# Altium project shield2Gen.PrjPcb
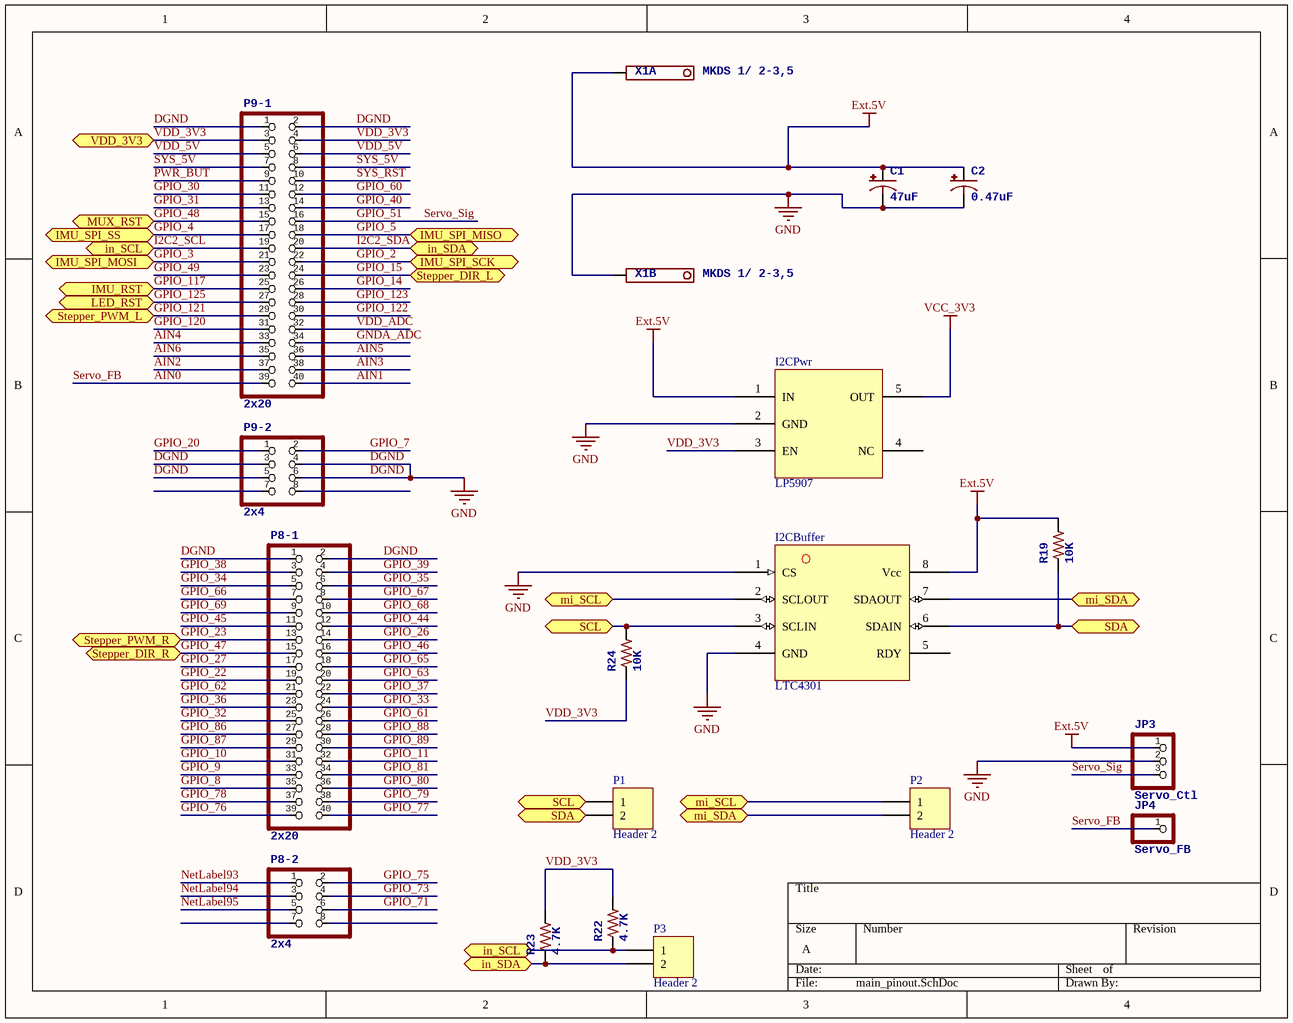
[diagram p0: main_pinout.SchDoc]
4 sheets, 46 parts. Net scope: flat (ports and power ports of the same name join across sheets).
Board file: SHield2Gen.PcbDoc
Sheets:
  main_pinout.SchDoc
  IRReceiver.SchDoc
  LED_Band.SchDoc
  IMU_Core.SchDoc

## Sheet main_pinout.SchDoc
size A

### Parts
C1  47uF  [E2,5-7]
C2  0.47uF  [E5-6]
I2CBuffer  LTC4301  [TSSOP-8]
I2CPwr  LP5907  [SOT23-5L]
JP3  Servo_Ctl  [1X03]
JP4  Servo_FB  [1X01]
P1  Header 2  [HDR1X2]
P2  Header 2  [HDR1X2]
P3  Header 2  [HDR1X2]
P8-1  2x20  [2X20]
P8-2  2x4  [2X04]
P9-1  2x20  [2X20]
P9-2  2x4  [2X04]
R19  10K  [R0805]
R22  4.7K  [R0805]
R23  4.7K  [R0805]
R24  10K  [R0805]
X1  MKDS 1/ 2-3,5  [1751248]  (parts A,B of 2)

### Ports
IMU_RST, IMU_SPI_MISO, IMU_SPI_MOSI, IMU_SPI_SCK, IMU_SPI_SS, in_SCL, in_SDA, LED_RST, mi_SCL, mi_SDA, MUX_RST, SCL, SDA, Stepper_DIR_L, Stepper_DIR_R, Stepper_PWM_L, Stepper_PWM_R, VDD_3V3

### Nets
DGND: C1.- C2.- I2CBuffer.1(CS) I2CBuffer.4(GND) I2CPwr.2(GND) JP3.2 P8-1.1 P8-1.2 P9-1.1 P9-1.2 P9-2.3 P9-2.4 P9-2.5 P9-2.6 X1.2(K)  [also labelled GND]
Ext.5V: C1.+ C2.+ I2CBuffer.8(Vcc) I2CPwr.1(IN) JP3.1 R19.2 X1.1(K)
VCC_3V3: I2CPwr.5(OUT)
AIN0: JP4.1 P9-1.39  [also labelled Servo_FB]
AIN1: P9-1.40
AIN2: P9-1.37
AIN3: P9-1.38
AIN4: P9-1.33
AIN5: P9-1.36
AIN6: P9-1.35
GNDA_ADC: P9-1.34
GPIO_2: P9-1.22 ; port IMU_SPI_SCK
GPIO_3: P9-1.21 ; port IMU_SPI_MOSI
GPIO_4: P9-1.17 ; port IMU_SPI_SS
GPIO_5: P9-1.18 ; port IMU_SPI_MISO
GPIO_7: P9-2.2
GPIO_8: P8-1.35
GPIO_9: P8-1.33
GPIO_10: P8-1.31
GPIO_11: P8-1.32
GPIO_14: P9-1.26
GPIO_15: P9-1.24 ; port Stepper_DIR_L
GPIO_20: P9-2.1
GPIO_22: P8-1.19
GPIO_23: P8-1.13 ; port Stepper_PWM_R
GPIO_26: P8-1.14
GPIO_27: P8-1.17
GPIO_30: P9-1.11
GPIO_31: P9-1.13
GPIO_32: P8-1.25
GPIO_33: P8-1.24
GPIO_34: P8-1.5
GPIO_35: P8-1.6
GPIO_36: P8-1.23
GPIO_37: P8-1.22
GPIO_38: P8-1.3
GPIO_39: P8-1.4
GPIO_40: P9-1.14
GPIO_44: P8-1.12
GPIO_45: P8-1.11
GPIO_46: P8-1.16
GPIO_47: P8-1.15 ; port Stepper_DIR_R
GPIO_48: P9-1.15 ; port MUX_RST
GPIO_49: P9-1.23
GPIO_51: JP3.3 P9-1.16  [also labelled Servo_Sig]
GPIO_60: P9-1.12
GPIO_61: P8-1.26
GPIO_62: P8-1.21
GPIO_63: P8-1.20
GPIO_65: P8-1.18
GPIO_66: P8-1.7
GPIO_67: P8-1.8
GPIO_68: P8-1.10
GPIO_69: P8-1.9
GPIO_71: P8-2.6
GPIO_73: P8-2.4
GPIO_75: P8-2.2
GPIO_76: P8-1.39
GPIO_77: P8-1.40
GPIO_78: P8-1.37
GPIO_79: P8-1.38
GPIO_80: P8-1.36
GPIO_81: P8-1.34
GPIO_86: P8-1.27
GPIO_87: P8-1.29
GPIO_88: P8-1.28
GPIO_89: P8-1.30
GPIO_117: P9-1.25 ; port IMU_RST
GPIO_120: P9-1.31
GPIO_121: P9-1.29 ; port Stepper_PWM_L
GPIO_122: P9-1.30
GPIO_123: P9-1.28
GPIO_125: P9-1.27 ; port LED_RST
I2C2_SCL: P3.1 P9-1.19 R22.1 ; port in_SCL
I2C2_SDA: P3.2 P9-1.20 R23.1 ; port in_SDA
NetLabel93: P8-2.1
NetLabel94: P8-2.3
NetLabel95: P8-2.5
PWR_BUT: P9-1.9
SYS_5V: P9-1.7 P9-1.8
SYS_RST: P9-1.10
VDD_3V3: I2CPwr.3(EN) P9-1.3 P9-1.4 R22.2 R23.2 R24.1 ; port VDD_3V3
VDD_5V: P9-1.5 P9-1.6
VDD_ADC: P9-1.32
NetADC0_9: I2CBuffer.6(SDAIN) P1.2 R19.1 ; port SDA
NetADC0_10: I2CBuffer.3(SCLIN) P1.1 R24.2 ; port SCL
NetI2CBuffer_2: I2CBuffer.2(SCLOUT) P2.1 ; port mi_SCL
NetI2CBuffer_7: I2CBuffer.7(SDAOUT) P2.2 ; port mi_SDA

Not connected (* = marked no-connect by the designer): I2CBuffer 5(RDY); I2CPwr 4(NC); P8-2 7 8; P9-2 7 8

### Library data of the parts
C1 = CPOL-USE2.5-7
C2 = CPOL-USE5-6
JP3 = PINHD-1X3
JP4 = PINHD-1X1
P1-P3 = Header 2: Header, 2-Pin; LatestRevisionDate: 17-Jul-2002; LatestRevisionNote: Re-released for DXP Platform.; Publisher: Altium Limited
P8-1 P9-1 = PINHD-2X20
P8-2 P9-2 = PINHD-2X4
R19 R22-R24 = R-US_R0805
X1 = 1751248: OC_FARNELL: unknown; OC_NEWARK: unknown

## Sheet IRReceiver.SchDoc
size A
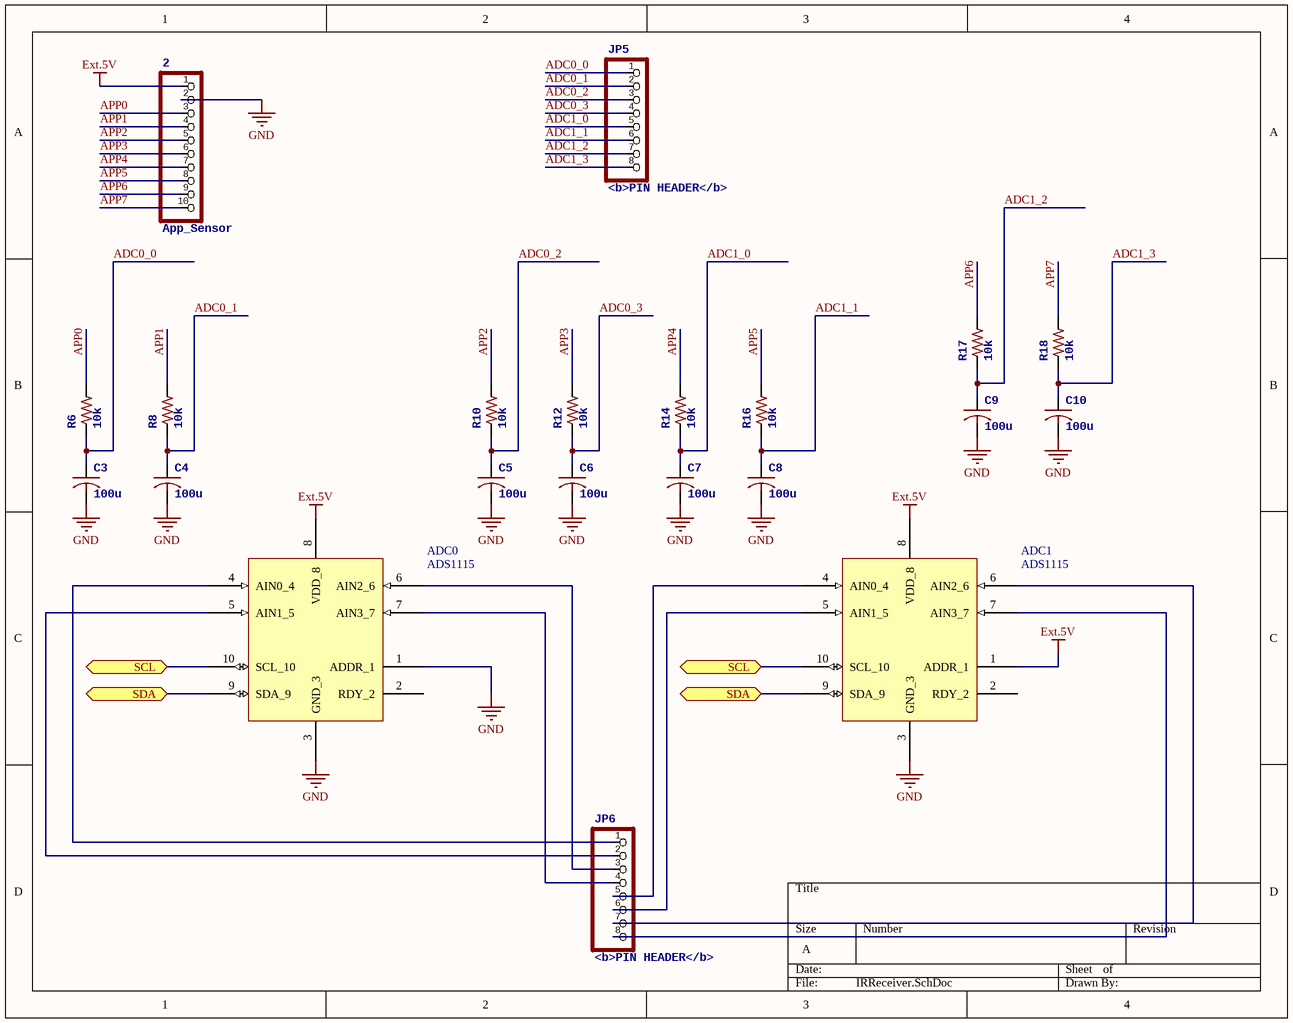
[diagram p1: IRReceiver.SchDoc]

### Parts
2  App_Sensor  [1X10-BIG]
ADC0  ADS1115  [10-VSSOP]
ADC1  ADS1115  [10-VSSOP]
C3  100u  [C0805]
C4  100u  [C0805]
C5  100u  [C0805]
C6  100u  [C0805]
C7  100u  [C0805]
C8  100u  [C0805]
C9  100u  [C0805]
C10  100u  [C0805]
JP5  <b>PIN HEADER</b>  [1X08-BIG]
JP6  <b>PIN HEADER</b>  [1X08-BIG]
R6  10k  [R0805]
R8  10k  [R0805]
R10  10k  [R0805]
R12  10k  [R0805]
R14  10k  [R0805]
R16  10k  [R0805]
R17  10k  [R0805]
R18  10k  [R0805]

### Ports
SCL, SDA

### Nets
Ext.5V: 2.1 ADC0.8(VDD_8) ADC1.1(ADDR_1) ADC1.8(VDD_8)
GND: 2.2 ADC0.1(ADDR_1) ADC0.3(GND_3) ADC1.3(GND_3) C3.2 C4.2 C5.2 C6.2 C7.2 C8.2 C9.2 C10.2  [project net DGND]
ADC0_0: C3.1 JP5.1 R6.1
ADC0_1: C4.1 JP5.2 R8.1
ADC0_2: C5.1 JP5.3 R10.1
ADC0_3: C6.1 JP5.4 R12.1
ADC1_0: C7.1 JP5.5 R14.1
ADC1_1: C8.1 JP5.6 R16.1
ADC1_2: C9.1 JP5.7 R17.1
ADC1_3: C10.1 JP5.8 R18.1
APP0: 2.3 R6.2
APP1: 2.4 R8.2
APP2: 2.5 R10.2
APP3: 2.6 R12.2
APP4: 2.7 R14.2
APP5: 2.8 R16.2
APP6: 2.9 R17.2
APP7: 2.10 R18.2
NetADC0_4: ADC0.4(AIN0_4) JP6.1
NetADC0_5: ADC0.5(AIN1_5) JP6.2
NetADC0_6: ADC0.6(AIN2_6) JP6.3
NetADC0_7: ADC0.7(AIN3_7) JP6.4
NetADC0_9: ADC0.9(SDA_9) ADC1.9(SDA_9) ; port SDA
NetADC0_10: ADC0.10(SCL_10) ADC1.10(SCL_10) ; port SCL
NetADC1_4: ADC1.4(AIN0_4) JP6.5
NetADC1_5: ADC1.5(AIN1_5) JP6.6
NetADC1_6: ADC1.6(AIN2_6) JP6.7
NetADC1_7: ADC1.7(AIN3_7) JP6.8

Not connected (* = marked no-connect by the designer): ADC0 2(RDY_2); ADC1 2(RDY_2)

### Library data of the parts
2 = PINHD-1X10
ADC0 ADC1 = ADS1115: vendor: TI
C3-C10 = C-USC0805
JP5 JP6 = PINHD-1X8BIG
R6 R8 R10 R12 R14 R16-R18 = R-US_R0805

## Sheet LED_Band.SchDoc
size A
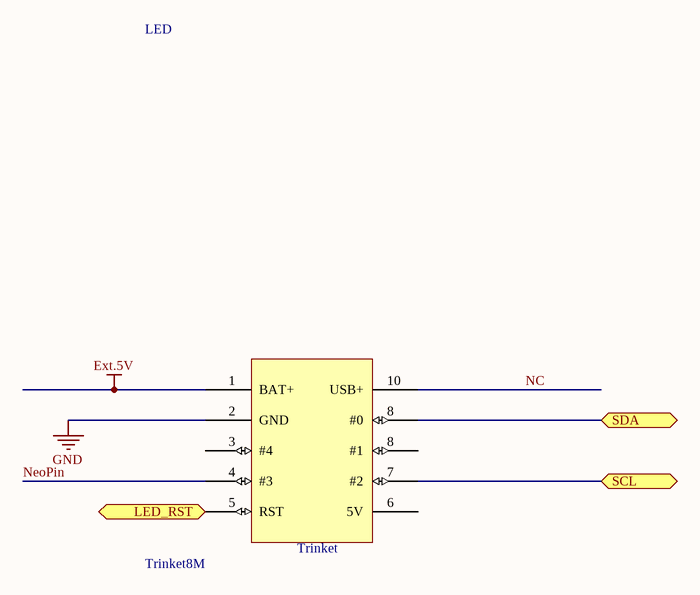
[diagram p2: LED_Band.SchDoc]

### Parts
LED  Trinket8M  [trinket]

### Ports
LED_RST, SCL, SDA

### Nets
Ext.5V: LED.1(BAT+)
GND: LED.2(GND)  [project net DGND]
GPIO_125: LED.5(RST) ; port LED_RST
NC: LED.10(USB+)
NeoPin: LED.4(#3)
NetADC0_9: LED.8(#0) ; port SDA
NetADC0_10: LED.7(#2) ; port SCL

Not connected (* = marked no-connect by the designer): LED 3(#4) 6(5V)

### Notes on the sheet
- (in symbol Trinket8M) Trinket

## Sheet IMU_Core.SchDoc
size A
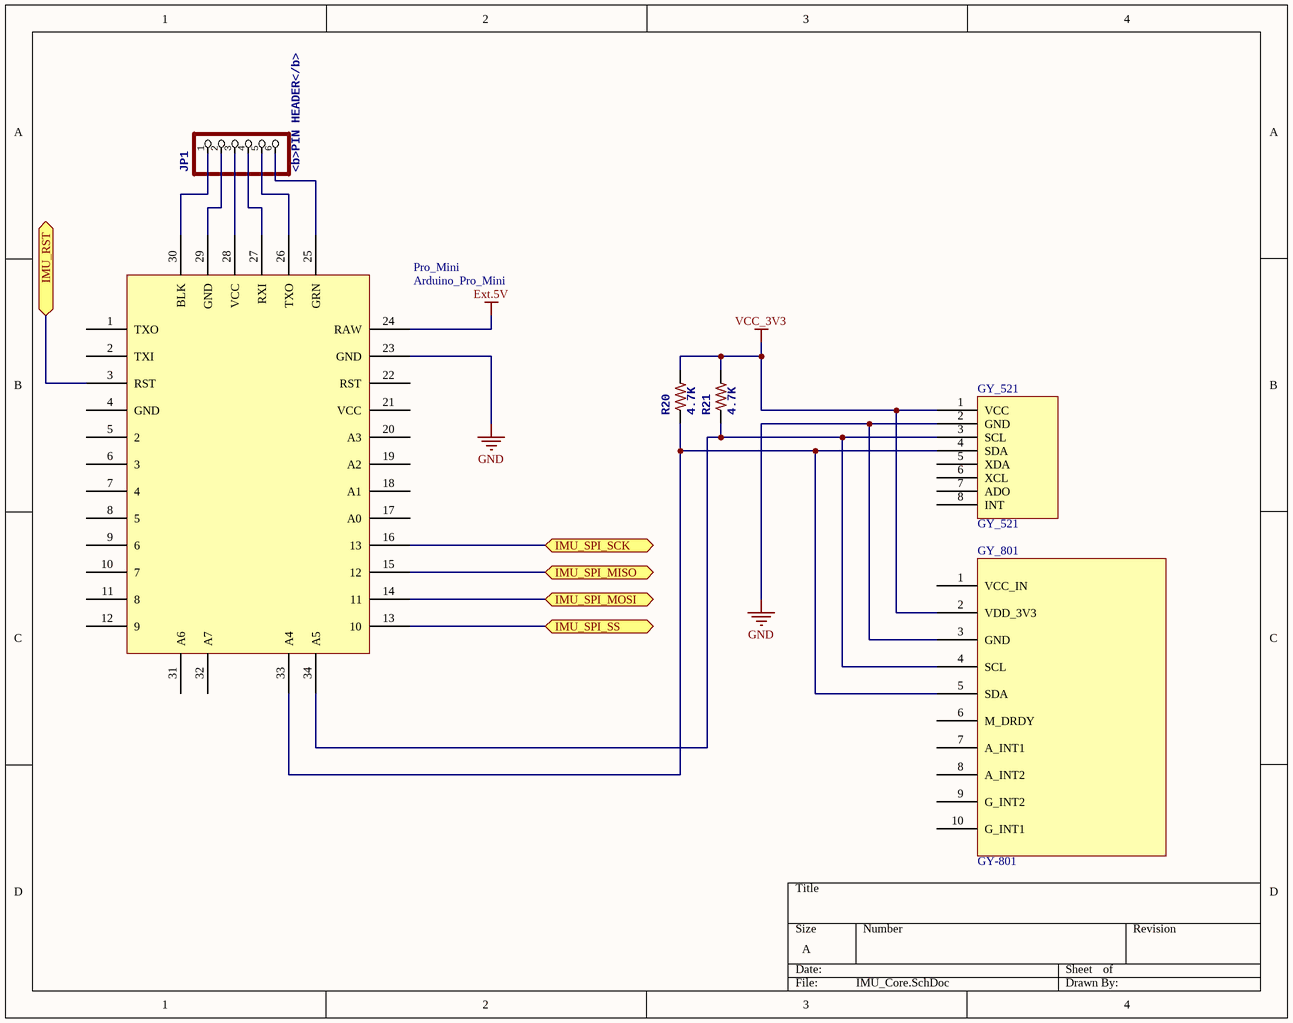
[diagram p3: IMU_Core.SchDoc]

### Parts
GY_521  GY_521  [sensor_8pin]
GY_801  GY-801  [Sensor_10Pin]
JP1  <b>PIN HEADER</b>  [1X06]
Pro_Mini  Arduino_Pro_Mini  [Arduino_pro_mini]
R20  4.7K  [R0805]
R21  4.7K  [R0805]

### Ports
IMU_RST, IMU_SPI_MISO, IMU_SPI_MOSI, IMU_SPI_SCK, IMU_SPI_SS

### Nets
Ext.5V: Pro_Mini.24(RAW)
GND: GY_521.2(GND) GY_801.3(GND) Pro_Mini.23(GND)  [project net DGND]
VCC_3V3: GY_521.1(VCC) GY_801.2(VDD_3V3) R20.2 R21.2
GPIO_2: Pro_Mini.16(13) ; port IMU_SPI_SCK
GPIO_3: Pro_Mini.14(11) ; port IMU_SPI_MOSI
GPIO_4: Pro_Mini.13(10) ; port IMU_SPI_SS
GPIO_5: Pro_Mini.15(12) ; port IMU_SPI_MISO
GPIO_117: Pro_Mini.3(RST) ; port IMU_RST
NetGY_521_3: GY_521.3(SCL) GY_801.4(SCL) Pro_Mini.34(A5) R21.1
NetGY_521_4: GY_521.4(SDA) GY_801.5(SDA) Pro_Mini.33(A4) R20.1
NetJP1_1: JP1.1 Pro_Mini.30(BLK)
NetJP1_2: JP1.2 Pro_Mini.29(GND)
NetJP1_3: JP1.3 Pro_Mini.28(VCC)
NetJP1_4: JP1.4 Pro_Mini.27(RXI)
NetJP1_5: JP1.5 Pro_Mini.26(TXO)
NetJP1_6: JP1.6 Pro_Mini.25(GRN)

Not connected (* = marked no-connect by the designer): GY_521 5(XDA) 6(XCL) 7(ADO) 8(INT); GY_801 1(VCC_IN) 6(M_DRDY) 7(A_INT1) 8(A_INT2) 9(G_INT2) 10(G_INT1); Pro_Mini 1(TXO) 2(TXI) 4(GND) 5(2) 6(3) 7(4) 8(5) 9(6) 10(7) 11(8) 12(9) 17(A0) 18(A1) 19(A2) 20(A3) 21(VCC) 22(RST) 31(A6) 32(A7)

### Library data of the parts
JP1 = PINHD-1X6
R20 R21 = R-US_R0805

## Nets that join several sheets
DGND: main_pinout (15 pins), IRReceiver (12 pins), LED_Band (LED.2), IMU_Core (GY_521.2 GY_801.3 Pro_Mini.23)
Ext.5V: main_pinout (7 pins), IRReceiver (2.1 ADC0.8 ADC1.1 ADC1.8), LED_Band (LED.1), IMU_Core (Pro_Mini.24)
VCC_3V3: main_pinout (I2CPwr.5), IMU_Core (GY_521.1 GY_801.2 R20.2 R21.2)
GPIO_2: main_pinout (P9-1.22), IMU_Core (Pro_Mini.16)
GPIO_3: main_pinout (P9-1.21), IMU_Core (Pro_Mini.14)
GPIO_4: main_pinout (P9-1.17), IMU_Core (Pro_Mini.13)
GPIO_5: main_pinout (P9-1.18), IMU_Core (Pro_Mini.15)
GPIO_117: main_pinout (P9-1.25), IMU_Core (Pro_Mini.3)
GPIO_125: main_pinout (P9-1.27), LED_Band (LED.5)
NetADC0_9: main_pinout (I2CBuffer.6 P1.2 R19.1), IRReceiver (ADC0.9 ADC1.9), LED_Band (LED.8)
NetADC0_10: main_pinout (I2CBuffer.3 P1.1 R24.2), IRReceiver (ADC0.10 ADC1.10), LED_Band (LED.7)